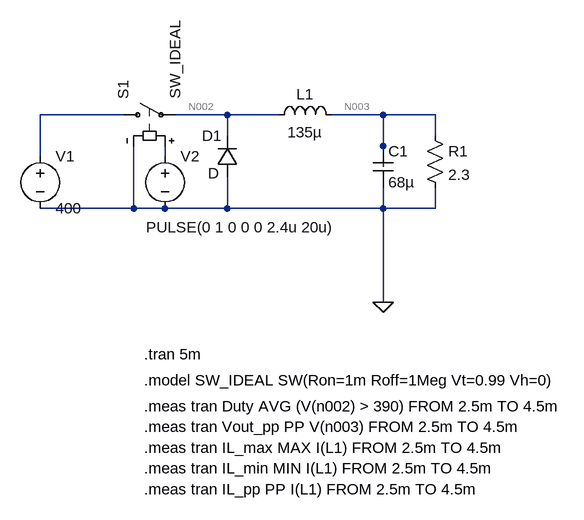
[diagram p0: schematic buck_400V_48V.asc]
buck_400V_48V.asc, the LTspice schematic file:
Version 4
SHEET 1 880 680
WIRE -96 16 -224 16
WIRE 64 16 -16 16
WIRE 144 16 64 16
WIRE 304 16 224 16
WIRE 384 16 304 16
WIRE 64 48 64 16
WIRE 384 48 384 16
WIRE 304 64 304 16
WIRE -224 80 -224 16
WIRE -32 80 -32 64
WIRE 304 96 304 64
WIRE -80 160 -80 64
WIRE -80 160 -224 160
WIRE -32 160 -80 160
WIRE 64 160 64 112
WIRE 64 160 -32 160
WIRE 304 160 304 128
WIRE 304 160 64 160
WIRE 384 160 384 128
WIRE 384 160 304 160
WIRE 304 304 304 160
FLAG 304 304 0
SYMBOL voltage -224 64 R0
WINDOW 123 0 0 Left 0
WINDOW 39 0 0 Left 0
SYMATTR InstName V1
SYMATTR Value 400
SYMBOL diode 80 112 R180
WINDOW 0 24 64 Left 2
WINDOW 3 28 6 Left 2
SYMATTR InstName D1
SYMBOL ind 128 32 R270
WINDOW 0 32 56 VTop 2
WINDOW 3 5 56 VBottom 2
SYMATTR InstName L1
SYMATTR Value 135µ
SYMBOL cap 288 64 R0
SYMATTR InstName C1
SYMATTR Value 68µ
SYMBOL res 368 32 R0
SYMATTR InstName R1
SYMATTR Value 2.3
SYMBOL voltage -32 64 R0
WINDOW 3 -29 125 Left 2
WINDOW 123 0 0 Left 0
WINDOW 39 0 0 Left 0
SYMATTR InstName V2
SYMATTR Value PULSE(0 1 0 0 0 2.4u 20u)
SYMBOL sw -112 16 R270
SYMATTR InstName S1
SYMATTR Value SW_IDEAL
TEXT -64 384 Left 2 !.tran 5m
TEXT -64 424 Left 2 !.model SW_IDEAL SW(Ron=1m Roff=1Meg Vt=0.99 Vh=0)
TEXT -64 464 Left 2 !.meas tran Duty AVG (V(n002) > 390) FROM 2.5m TO 4.5m
TEXT -64 496 Left 2 !.meas tran Vout_pp PP V(n003) FROM 2.5m TO 4.5m
TEXT -64 528 Left 2 !.meas tran IL_max MAX I(L1) FROM 2.5m TO 4.5m
TEXT -64 560 Left 2 !.meas tran IL_min MIN I(L1) FROM 2.5m TO 4.5m
TEXT -64 592 Left 2 !.meas tran IL_pp PP I(L1) FROM 2.5m TO 4.5m

The netlist it stands for:
* buck_400V_48V.asc
V1 N001 0 400
D1 0 N002 D
L1 N002 N003 135µ
C1 N003 0 68µ
R1 N003 0 2.3
V2 N004 0 PULSE(0 1 0 0 0 2.4u 20u)
S1 N001 N002 N004 0 SW_IDEAL
.model D D
.lib standard.dio
.tran 5m
.model SW_IDEAL SW(Ron=1m Roff=1Meg Vt=0.99 Vh=0)
.meas tran Duty AVG (V(n002) > 390) FROM 2.5m TO 4.5m
.meas tran Vout_pp PP V(n003) FROM 2.5m TO 4.5m
.meas tran IL_max MAX I(L1) FROM 2.5m TO 4.5m
.meas tran IL_min MIN I(L1) FROM 2.5m TO 4.5m
.meas tran IL_pp PP I(L1) FROM 2.5m TO 4.5m
.backanno
.end